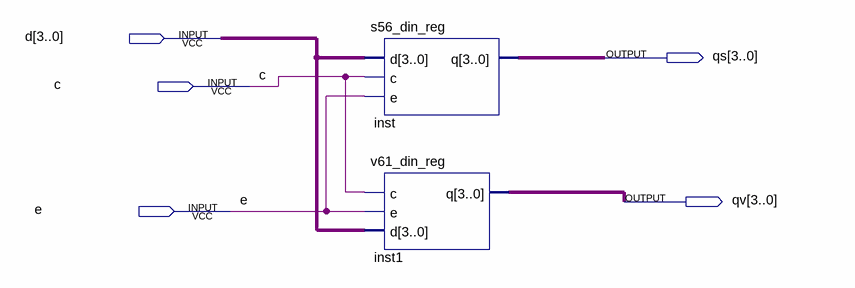
[diagram p0: schematic sheet]
// Quartus schematic sv56.bdf as structural Verilog: 2 symbols, 5 pins
module sv56 (
  input  [3:0] d,
  input  c,
  input  e,
  output [3:0] qs,
  output [3:0] qv
);

  s56_din_reg inst (.d(d), .c(c), .e(e), .q(qs));
  v61_din_reg inst1 (.c(c), .e(e), .d(d), .q(qv));
endmodule
